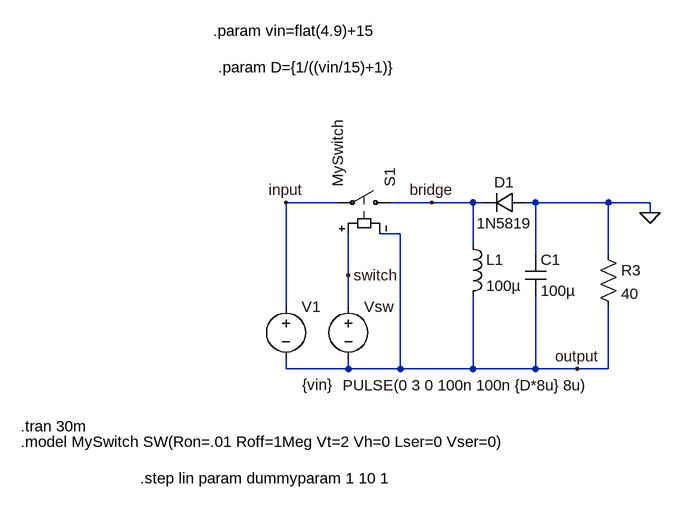
[diagram p0: schematic variablecircuit.asc]
variablecircuit.asc, the LTspice schematic file:
Version 4
SHEET 1 936 680
WIRE 144 -48 64 -48
WIRE 288 -48 224 -48
WIRE 352 -48 288 -48
WIRE 368 -48 352 -48
WIRE 448 -48 432 -48
WIRE 560 -48 448 -48
WIRE 624 -48 560 -48
WIRE 624 -32 624 -48
WIRE 240 0 208 0
WIRE 352 16 352 -48
WIRE 448 32 448 -48
WIRE 560 32 560 -48
WIRE 160 64 160 0
WIRE 64 112 64 -48
WIRE 160 112 160 64
WIRE 64 208 64 192
WIRE 160 208 160 192
WIRE 160 208 64 208
WIRE 240 208 240 0
WIRE 240 208 160 208
WIRE 352 208 352 96
WIRE 352 208 240 208
WIRE 448 208 448 96
WIRE 448 208 352 208
WIRE 512 208 448 208
WIRE 560 208 560 112
WIRE 560 208 512 208
FLAG 624 -32 0
FLAG 512 208 output
FLAG 160 64 switch
FLAG 288 -48 bridge
FLAG 64 -48 input
SYMBOL voltage 64 96 R0
WINDOW 3 25 136 Left 2
WINDOW 123 0 0 Left 0
WINDOW 39 0 0 Left 0
SYMATTR Value {vin}
SYMATTR InstName V1
SYMBOL voltage 160 96 R0
WINDOW 3 -9 137 Left 2
WINDOW 123 0 0 Left 0
WINDOW 39 0 0 Left 0
SYMATTR Value PULSE(0 3 0 100n 100n {D*8u} 8u)
SYMATTR InstName Vsw
SYMBOL ind 336 0 R0
SYMATTR InstName L1
SYMATTR Value 100µ
SYMBOL cap 432 32 R0
SYMATTR InstName C1
SYMATTR Value 100µ
SYMBOL res 544 16 R0
SYMATTR InstName R3
SYMATTR Value 40
SYMBOL sw 240 -48 M270
SYMATTR InstName S1
SYMATTR Value MySwitch
SYMBOL diode 432 -64 R90
WINDOW 0 0 32 VBottom 2
WINDOW 3 32 32 VTop 2
SYMATTR InstName D1
SYMATTR Value 1N5819
TEXT -344 296 Left 2 !.tran 30m
TEXT -344 320 Left 2 !.model MySwitch SW(Ron=.01 Roff=1Meg Vt=2 Vh=0 Lser=0 Vser=0)
TEXT -48 -312 Left 2 !.param vin=flat(4.9)+15
TEXT -40 -256 Left 2 !.param D={1/((vin/15)+1)}
TEXT -160 376 Left 2 !.step lin param dummyparam 1 10 1

The netlist it stands for:
* variablecircuit.asc
V1 input output {vin}
Vsw switch output PULSE(0 3 0 100n 100n {D*8u} 8u)
L1 bridge output 100µ
C1 0 output 100µ
R3 0 output 40
S1 bridge input switch output MySwitch
D1 0 bridge 1N5819
.model D D
.lib standard.dio
.tran 30m
.model MySwitch SW(Ron=.01 Roff=1Meg Vt=2 Vh=0 Lser=0 Vser=0)
.param vin=flat(4.9)+15
.param D={1/((vin/15)+1)}
.step lin param dummyparam 1 10 1
.backanno
.end